# Altium project Snap4.PrjPcb
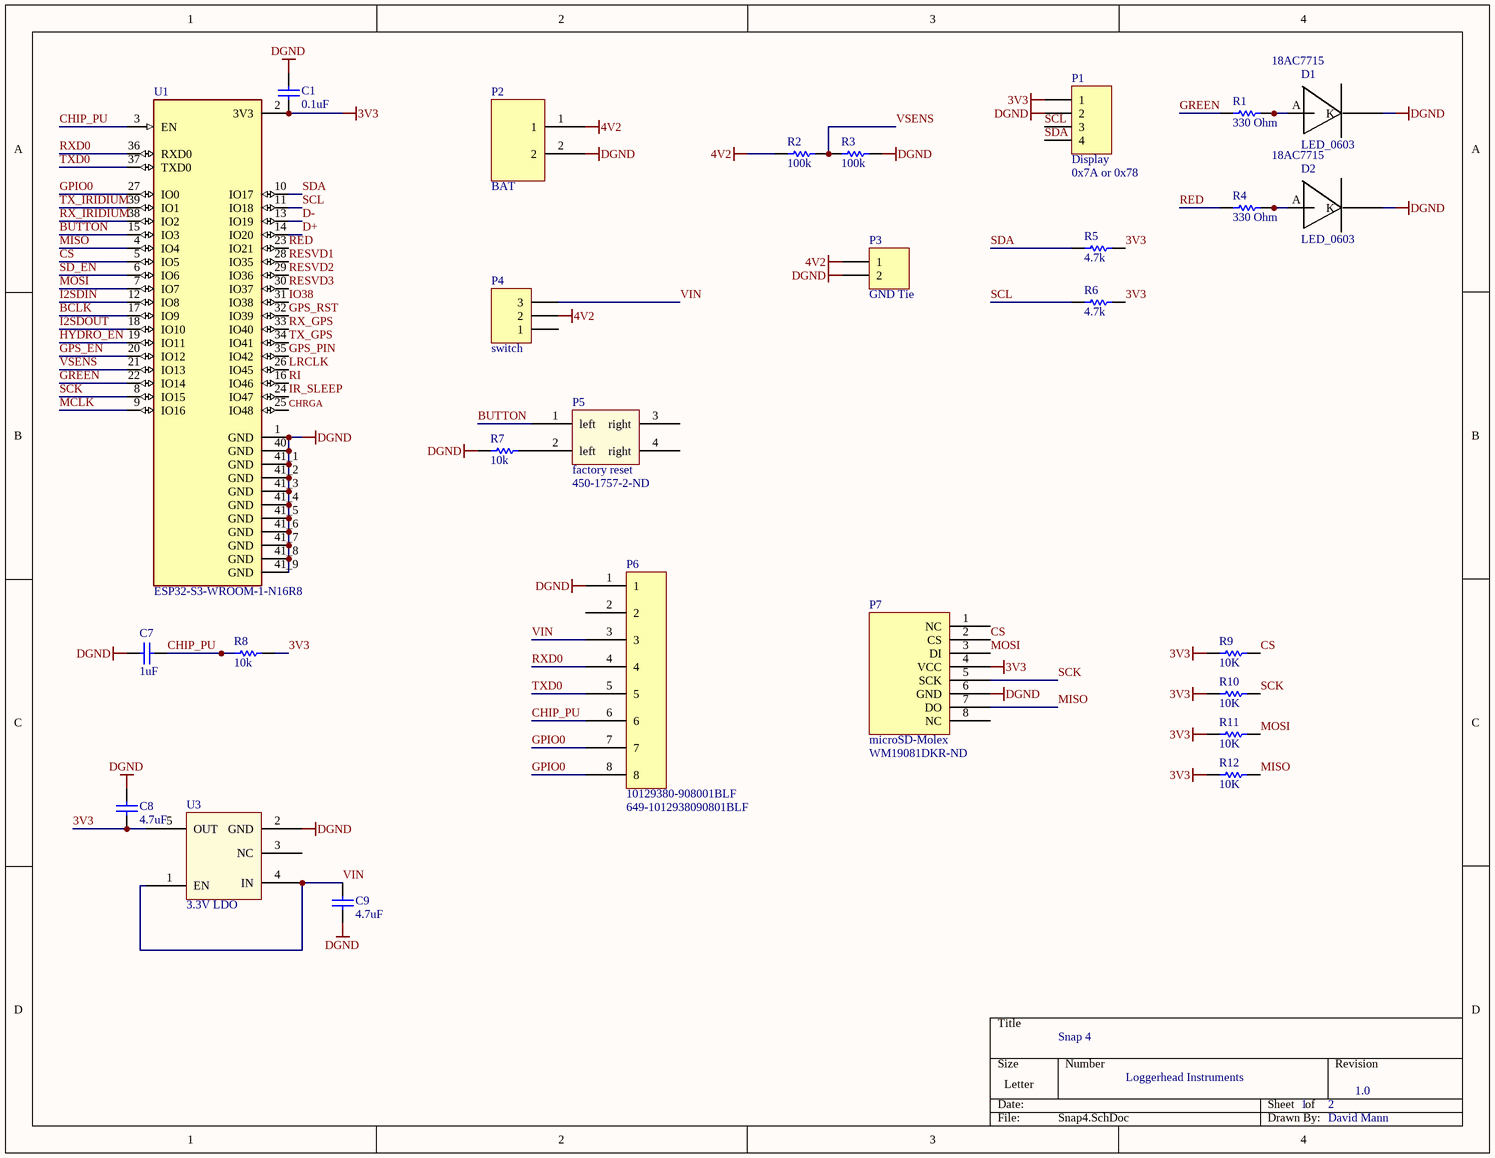
[diagram p0: Snap4.SchDoc]
1 sheet, 27 parts. Net scope: global (net labels, ports and power ports of the same name join across sheets).
Board file: Snap4.PcbDoc

## Sheet Snap4.SchDoc
size Letter; SheetNumber: 1; SheetTotal: 2

### Parts
C1  0.1uF  [0402]
C7  1uF  [0402]
C8  4.7uF  [0402]
C9  4.7uF  [0402]
D1  LED_0603  Supplier Part Number 1: 18AC7715  [Diode0603]
D2  LED_0603  Supplier Part Number 1: 18AC7715  [Diode0603]
P1  Display  [HDR1X4]
P2  BAT  [HDR_2x1_2mm]
P3  GND Tie  [HDR1X2]
P4  switch  [HDR1X3]
P5  factory reset  Supplier Part Number 1: 450-1757-2-ND  [SOP4]
P6  10129380-908001BLF  Supplier Part Number 1: 649-1012938090801BLF  [Header_8_SMT]
P7  microSD-Molex  Supplier Part Number 1: WM19081DKR-ND  [microSD_Molex_hinged]
R1  330 Ohm  [2-0402]
R2  100k  [3-0603]
R3  100k  [3-0603]
R4  330 Ohm  [2-0402]
R5  4.7k  [3-0603]
R6  4.7k  [3-0603]
R7  10k  [2-0402]
R8  10k  [2-0402]
R9  10K  [3-0603]
R10  10K  [3-0603]
R11  10K  [3-0603]
R12  10K  [3-0603]
U1  ESP32-S3-WROOM-1-N16R8  [XCVR_ESP32-S3-WROOM-1-N16R2]
U3  3.3V LDO  [AP7361C-33Y5-13]

### Nets
3V3: C1.1 C8.2 P1.1 P7.4(VCC) R5.2 R6.2 R8.1 R9.1 R10.1 R11.1 R12.1 U1.2(3V3) U3.5(OUT)
4V2: P2.1 P3.1 P4.2 R2.2
DGND: C1.2 C7.2 C8.1 C9.2 D1.K D2.K P1.2 P2.2 P3.2 P6.1 P7.6(GND) R3.1 R7.2 U1.1(GND) U1.40(GND) U1.41_1(GND) U1.41_2(GND) U1.41_3(GND) U1.41_4(GND) U1.41_5(GND) U1.41_6(GND) U1.41_7(GND) U1.41_8(GND) U1.41_9(GND) U3.2(GND)
BCLK: U1.17(IO9)
BUTTON: P5.1(left) U1.15(IO3)
CHIP_PU: C7.1 P6.6 R8.2 U1.3(EN)
CHRGA: U1.25(IO48)
CS: P7.2(CS) R9.2 U1.5(IO5)
D+: U1.14(IO20)
D-: U1.13(IO19)
GPIO0: P6.7 P6.8 U1.27(IO0)
GPS_EN: U1.20(IO12)
GPS_PIN: U1.35(IO42)
GPS_RST: U1.32(IO39)
GREEN: R1.2 U1.22(IO14)
HYDRO_EN: U1.19(IO11)
I2SDIN: U1.12(IO8)
I2SDOUT: U1.18(IO10)
IO38: U1.31(IO38)
IR_SLEEP: U1.24(IO47)
LRCLK: U1.26(IO45)
MCLK: U1.9(IO16)
MISO: P7.7(DO) R12.2 U1.4(IO4)
MOSI: P7.3(DI) R11.2 U1.7(IO7)
RED: R4.2 U1.23(IO21)
RESVD1: U1.28(IO35)
RESVD2: U1.29(IO36)
RESVD3: U1.30(IO37)
RI: U1.16(IO46)
RX_GPS: U1.33(IO40)
RX_IRIDIUM: U1.38(IO2)
RXD0: P6.4 U1.36(RXD0)
SCK: P7.5(SCK) R10.2 U1.8(IO15)
SCL: P1.3 R6.1 U1.11(IO18)
SD_EN: U1.6(IO6)
SDA: P1.4 R5.1 U1.10(IO17)
TX_GPS: U1.34(IO41)
TX_IRIDIUM: U1.39(IO1)
TXD0: P6.5 U1.37(TXD0)
VIN: C9.1 P4.3 P6.3 U3.1(EN) U3.4(IN)
VSENS: R2.1 R3.2 U1.21(IO13)
NetD1_A: D1.A R1.1
NetD2_A: D2.A R4.1
NetP5_2: P5.2(left) R7.1

Not connected (* = marked no-connect by the designer): P4 1; P5 3(right) 4(right); P6 2; P7 1(NC) 8(NC); U3 3(NC)

### Notes on the sheet
- (near P1) 0x7A or 0x78
- Snap 4
- Loggerhead Instruments
- 1
- 2
- 1.0
- David Mann

### Library data of the parts
C1 = C0402: Ceramic Chip Capacitor - Standard; Note: Footprint corresponds to dimensions for bulk cassette packaging. This case size has tightened tolerances.; Published: 17-Jul-2002; LatestRevisionDate: 19-Mar-2004; LatestRevisionNote: Silkscreen size reduced.; DatasheetDocument: Mar-2001; PackageDocument: Mar-2001; PackageReference: 0402; Publisher: Altium Limited; Code_JEITA: 0402; Code_IPC: 1005 [0402]; ComponentLink1Description: Manufacturer Link; ComponentLink1URL: http://www.kemet.com/; ComponentLink2Description: Datasheet; ComponentLink2URL: http://www.kemet.com/kemet/web/homepage/kechome.nsf/vapubfilesname/F3102TA.pdf/$file/F3102TA.pdf; Value: 0.1uF
C7-C9 = C0402: Ceramic Chip Capacitor - Standard; Note: Footprint corresponds to dimensions for bulk cassette packaging. This case size has tightened tolerances.; Value: 0.1uF; Published: 17-Jul-2002; LatestRevisionDate: 19-Mar-2004; LatestRevisionNote: Silkscreen size reduced.; DatasheetDocument: Mar-2001; PackageDocument: Mar-2001; PackageReference: 0402; Publisher: Altium Limited; Code_JEITA: 0402; Code_IPC: 1005 [0402]; ComponentLink1Description: Manufacturer Link; ComponentLink1URL: http://www.kemet.com/; ComponentLink2Description: Datasheet; ComponentLink2URL: http://www.kemet.com/kemet/web/homepage/kechome.nsf/vapubfilesname/F3102TA.pdf/$file/F3102TA.pdf
P1 = Header 4: Header, 4-Pin; LatestRevisionDate: 17-Jul-2002; LatestRevisionNote: Re-released for DXP Platform.; Publisher: Altium Limited
P2 = HDR_2x1_2mm
P3 = Header 2: Header, 2-Pin; LatestRevisionDate: 17-Jul-2002; LatestRevisionNote: Re-released for DXP Platform.; Publisher: Altium Limited
P4 = Header 3: Header, 3-Pin; LatestRevisionDate: 17-Jul-2002; LatestRevisionNote: Re-released for DXP Platform.; Publisher: Altium Limited
P5 = pushbutton: Supplier 1: Digi-Key
P6 = Header8_SMT: Surface mount header; Supplier 1: Mouser
P7 = microSD_Molex_hinged: Supplier 1: Digi-Key
R1 R4 R7 R8 = ERJ2RB: Precision Thick Film Chip Resistor, 10 Ohm to 1M Ohm Range, 1% and 0.5% Tolerance, 0402 Size, 0.063 W; Published: 17-Dec-2003; LatestRevisionDate: 19-Mar-2004; LatestRevisionNote: Silkscreen size reduced.; PackageDocument: Mar-2003; PackageReference: 2-0402; Publisher: Altium Limited; Code_IPC: 1005 [0402]; ComponentLink1Description: Manufacturer Link; ComponentLink1URL: http://www.panasonic.com/industrial/components/resistive_products.htm; ComponentLink2Description: Datasheet; ComponentLink2URL: http://www.panasonic.com/industrial/components/pdf/AOA0000CE2.pdf
R2 R3 R5 R6 = ERJ3RK: Precision Thick Film Chip Resistor, 10 Ohm to 1M Ohm Range, 1% and 0.5% Tolerance, 0603 Size, 0.063 W; Published: 17-Dec-2003; LatestRevisionDate: 19-Mar-2004; LatestRevisionNote: Silkscreen size reduced.; PackageDocument: Mar-2003; PackageReference: 3-0603; Publisher: Altium Limited; Code_IPC: 1608 [0603]; ComponentLink1Description: Manufacturer Link; ComponentLink1URL: http://www.panasonic.com/industrial/components/resistive_products.htm; ComponentLink2Description: Datasheet; ComponentLink2URL: http://www.panasonic.com/industrial/components/pdf/AOA0000CE2.pdf
R9-R12 = ERJ3EK: Precision Thick Film Chip Resistor, 10 Ohm to 1M Ohm Range, 1% and 0.5% Tolerance, 0603 Size, 0.063 W; Published: 17-Dec-2003; LatestRevisionDate: 19-Mar-2004; LatestRevisionNote: Silkscreen size reduced.; PackageDocument: Mar-2003; PackageReference: 3-0603; Publisher: Altium Limited; Code_IPC: 1608 [0603]; ComponentLink1Description: Manufacturer Link; ComponentLink1URL: http://www.panasonic.com/industrial/components/resistive_products.htm; ComponentLink2Description: Datasheet; ComponentLink2URL: http://www.panasonic.com/industrial/components/pdf/AOA0000CE2.pdf
U1 = ESP32-S3-WROOM-1-N16R2: Bluetooth, WiFi 802.11b/g/n, Bluetooth v5.0 Transceiver Module 2.4GHz PCB Trace Surface Mount; MF: Espressif Systems; Package: None; Availability: In Stock; SnapEDA_Link: https://www.snapeda.com/parts/ESP32-S3-WROOM-1-N16R2/Espressif+Systems/view-part/?ref=snap; MP: ESP32-S3-WROOM-1-N16R2; Value: *; Purchase-URL: https://pricing.snapeda.com/search/part/ESP32-S3-WROOM-1-N16R2/?ref=eda; Price: None; Check_prices: https://www.snapeda.com/parts/ESP32-S3-WROOM-1-N16R2/Espressif+Systems/view-part/?ref=eda
U3 = AP7361C-33Y5-13
D1 D2 = LED_0603: Supplier 1: Newark